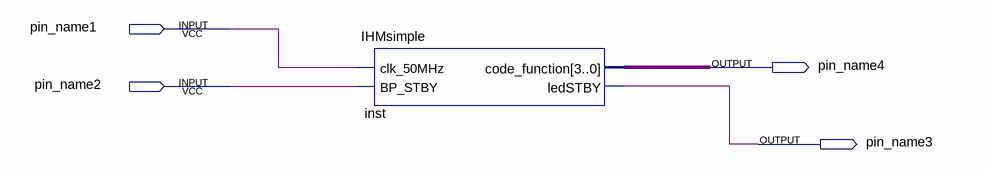
[diagram p0: schematic sheet]
// Quartus schematic Block1.bdf as structural Verilog: 1 symbols, 4 pins
module Block1 (
  input  pin_name1,
  input  pin_name2,
  output pin_name4,
  output pin_name3
);

  wire [3:0] inst_code_function;

  IHMsimple inst (.clk_50MHz(pin_name1), .BP_STBY(pin_name2), .code_function(inst_code_function), .ledSTBY(pin_name3));
endmodule
